# EAGLE design flossjtag (EAGLE 7.4.0)
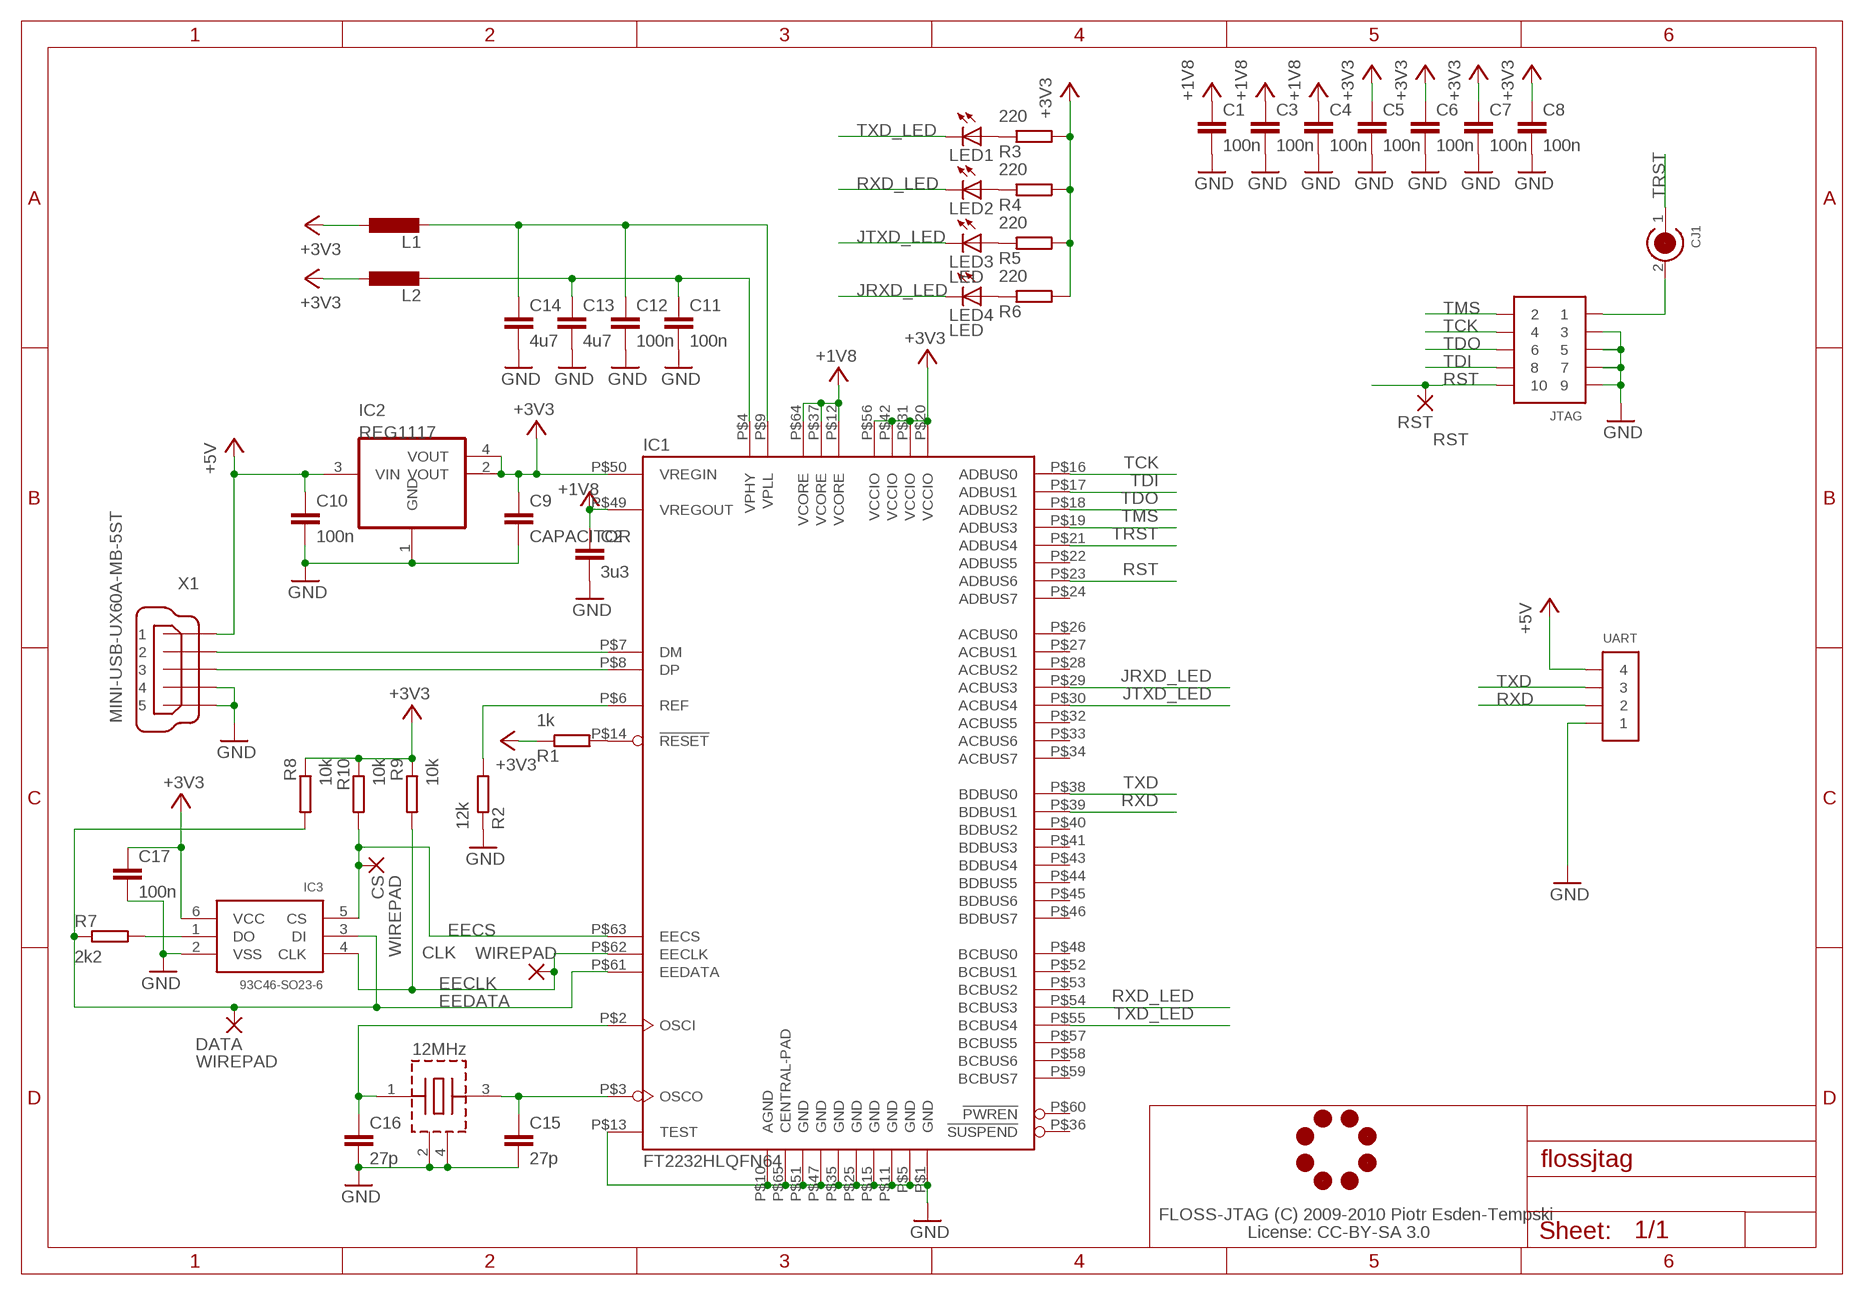
[diagram p0: schematic, sheet 1]

## Parts
C1  100n  CAPACITOR-0603  [0603-CAP]
C2  3u3  CAPACITOR-0603  [0603-CAP]
C3  100n  CAPACITOR-0603  [0603-CAP]
C4  100n  CAPACITOR-0603  [0603-CAP]
C5  100n  CAPACITOR-0603  [0603-CAP]
C6  100n  CAPACITOR-0603  [0603-CAP]
C7  100n  CAPACITOR-0603  [0603-CAP]
C8  100n  CAPACITOR-0603  [0603-CAP]
C9  CAPACITOR  [0603-CAP]
C10  100n  CAPACITOR  [0603-CAP]
C11  100n  CAPACITOR-0603  [0603-CAP]
C12  100n  CAPACITOR-0603  [0603-CAP]
C13  4u7  CAPACITOR-0603  [0603-CAP]
C14  4u7  CAPACITOR-0603  [0603-CAP]
C15  27p  CAPACITOR  [0603-CAP]
C16  27p  CAPACITOR  [0603-CAP]
C17  100n  CAPACITOR  [0603-CAP]
CJ1  CIRC_JMP  [CIRC_JMP]
CLK  WIREPAD  [SMD1,27]
CS  WIREPAD  [SMD1,27]
DATA  WIREPAD  [SMD1,27]
IC1  FT2232HLQFN64  [QFN64]
IC2  REG1117  [SOT223]
IC3  93C46-SO23-6  [SO23-6]
JL1  JOBY_LOGO-6MIL  [JOBY_LOGO_6MIL]
JTAG  CONN_5-2-FTSH-V  [FTSH-105-DV]
L1  INDUCTOR-0603  [0603-IND]
L2  INDUCTOR-0603  [0603-IND]
LED1  LED  [0603-LED]
LED2  LED  [0603-LED]
LED3  LED  [0603-LED]
LED4  LED  [0603-LED]
R1  1k  RESISTOR-0603  [0603-RES]
R2  12k  RESISTOR-0603  [0603-RES]
R3  220  RESISTOR-0603  [0603-RES]
R4  220  RESISTOR-0603  [0603-RES]
R5  220  RESISTOR-0603  [0603-RES]
R6  220  RESISTOR-0603  [0603-RES]
R7  2k2  RESISTOR-0603  [0603-RES]
R8  10k  RESISTOR-0603  [0603-RES]
R9  10k  RESISTOR-0603  [0603-RES]
R10  10k  RESISTOR-0603  [0603-RES]
RST  RST  WIREPAD  [SMD1,27]
UART  CONN_4-1  [PB-53261-04]
X1  MINI-USB-UX60A-MB-5ST  [UX60A-MB-5ST]
X3  12MHz  NX3225SA  [NX3225SA]

## Nets
+3V3: C5.P$1 C6.P$1 C7.P$1 C8.P$1 C9.P$1 C17.P$1 IC1.P$20(VCCIO) IC1.P$31(VCCIO) IC1.P$42(VCCIO) IC1.P$50(VREGIN) IC1.P$56(VCCIO) IC2.2(VOUT) IC2.4(VOUT) IC3.6(VCC) L1.P$1 L2.P$1 R1.P$1 R3.P$2 R4.P$2 R5.P$2 R6.P$2 R8.P$1 R9.P$1 R10.P$1
+5V: C10.P$1 IC2.3(VIN) UART.4 X1.1
EECLK: CLK.1(P) IC1.P$62(EECLK) IC3.4(CLK) R9.P$2
EECS: CS.1(P) IC1.P$63(EECS) IC3.5(CS) R10.P$2
EEDATA: DATA.1(P) IC1.P$61(EEDATA) IC3.3(DI) R7.P$1 R8.P$2
GND: C1.P$2 C2.P$2 C3.P$2 C4.P$2 C5.P$2 C6.P$2 C7.P$2 C8.P$2 C9.P$2 C10.P$2 C11.P$2 C12.P$2 C13.P$2 C14.P$2 C15.P$2 C16.P$2 C17.P$2 IC1.P$1(GND) IC1.P$5(GND) IC1.P$10(AGND) IC1.P$11(GND) IC1.P$13(TEST) IC1.P$15(GND) IC1.P$25(GND) IC1.P$35(GND) IC1.P$47(GND) IC1.P$51(GND) IC1.P$65(CENTRAL-PAD) IC2.1(GND) IC3.2(VSS) JTAG.3 JTAG.5 JTAG.7 JTAG.9 R2.P$1 UART.1 X1.4 X1.5 X3.2(GND) X3.4(GND)
JRXD_LED: IC1.P$29(ACBUS3) LED4.C
JTXD_LED: IC1.P$30(ACBUS4) LED3.C
N$1: IC1.P$14(!RESET) R1.P$2
N$2: IC1.P$6(REF) R2.P$2
N$3: IC1.P$7(DM) X1.2
N$4: IC1.P$8(DP) X1.3
N$6: C16.P$1 IC1.P$2(OSCI) X3.1(XTAL)
N$7: C12.P$1 C14.P$1 IC1.P$9(VPLL) L1.P$2
N$8: C11.P$1 C13.P$1 IC1.P$4(VPHY) L2.P$2
N$9: C15.P$1 IC1.P$3(OSCO) X3.3(XTAL)
N$10: LED1.A R3.P$1
N$11: LED2.A R4.P$1
N$12: LED3.A R5.P$1
N$13: LED4.A R6.P$1
N$17: IC3.1(DO) R7.P$2
N$19: CJ1.2 JTAG.1
RST: IC1.P$23(ADBUS6) JTAG.10 RST.1(P)
RXD: IC1.P$39(BDBUS1) UART.2
RXD_LED: IC1.P$54(BCBUS3) LED2.C
TCK: IC1.P$16(ADBUS0) JTAG.4
TDI: IC1.P$17(ADBUS1) JTAG.8
TDO: IC1.P$18(ADBUS2) JTAG.6
TMS: IC1.P$19(ADBUS3) JTAG.2
TRST: CJ1.1 IC1.P$21(ADBUS4)
TXD: IC1.P$38(BDBUS0) UART.3
TXD_LED: IC1.P$55(BCBUS4) LED1.C
VCC: C1.P$1 C2.P$1 C3.P$1 C4.P$1 IC1.P$12(VCORE) IC1.P$37(VCORE) IC1.P$49(VREGOUT) IC1.P$64(VCORE) ; supply symbol labelled +1V8
Unconnected: IC1.P$22(ADBUS5) IC1.P$24(ADBUS7) IC1.P$26(ACBUS0) IC1.P$27(ACBUS1) IC1.P$28(ACBUS2) IC1.P$32(ACBUS5) IC1.P$33(ACBUS6) IC1.P$34(ACBUS7) IC1.P$36(!SUSPEND) IC1.P$40(BDBUS2) IC1.P$41(BDBUS3) IC1.P$43(BDBUS4) IC1.P$44(BDBUS5) IC1.P$45(BDBUS6) IC1.P$46(BDBUS7) IC1.P$48(BCBUS0) IC1.P$52(BCBUS1) IC1.P$53(BCBUS2) IC1.P$57(BCBUS5) IC1.P$58(BCBUS6) IC1.P$59(BCBUS7) IC1.P$60(!PWREN)

## Notes on the sheet
- FLOSS-JTAG (C) 2009-2010 Piotr Esden-Tempski
- License: CC-BY-SA 3.0

## Library data of the parts
C1-C8 C11-C14 = res_cap:CAPACITOR
C9 C10 C15-C17 = open-bldc:CAPACITOR
CJ1 = fancy_jumpers:CIRC_JMP
CLK CS DATA RST = wirepad:WIREPAD: Wire PAD connect wire on PCB
IC1 = ftdi-jtag:FT2232HL
IC2 = burr-brown:REG1117: 800mA and 1A Low Dropout (LDO) Positive Regulator 1.8V, 2.5V, 2.85V, 3.3V, 5V, and Adj
IC3 = misc:93C46: Microchip: 93AA46A/B/C, 93LC46A/B/C, 93C46A/B/C
JL1 = aspirin:JOBY_LOGO
JTAG = pel_misc:CONN_5-2
L1 L2 = res_cap:INDUCTOR
LED1-LED4 = open-bldc:LED
R1-R10 = res_cap:RESISTOR
UART = open-bldc:CONN_4-1
X1 = con-hirose:MINI-USB-: MINI USB Connector Source: http://www.hirose.co.jp/cataloge_hp/e24000019.pdf
X3 = misc:NX3225SA

## Board
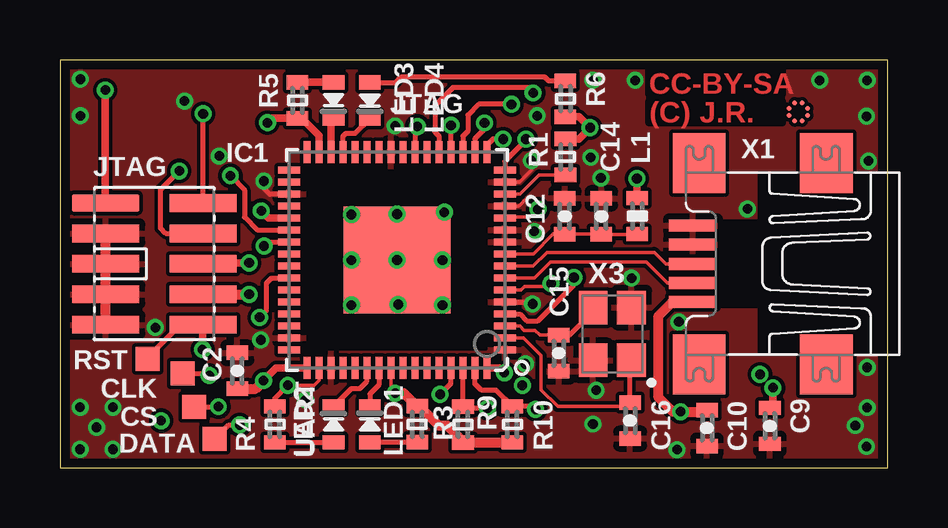
[diagram p1: board, top side]
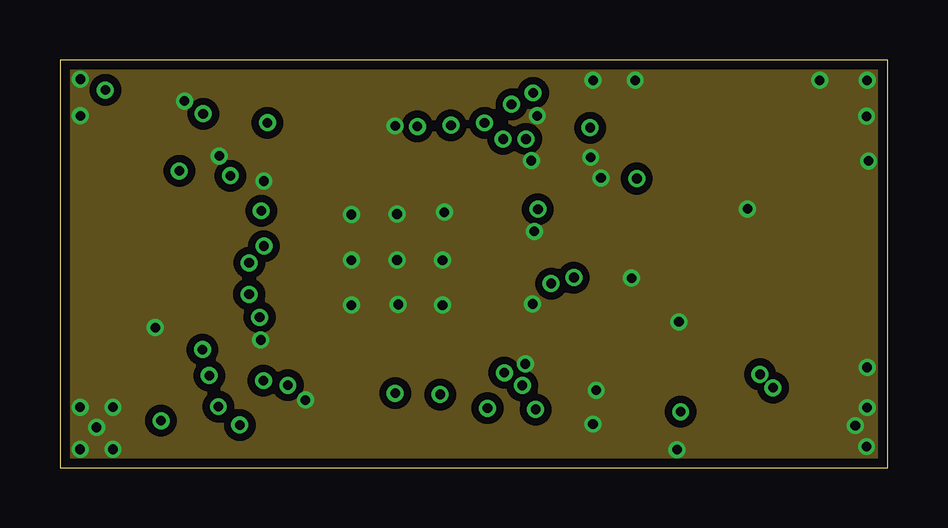
[diagram p2: board, inner layer Route2]
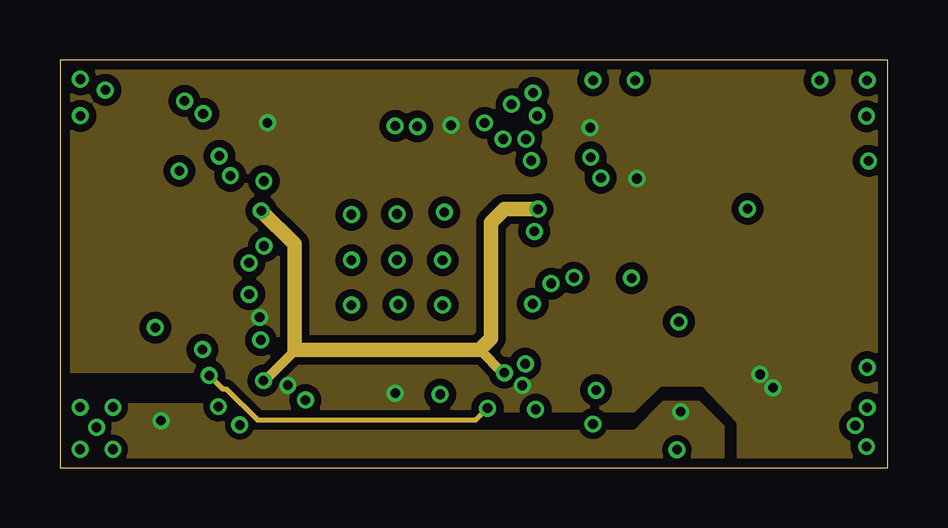
[diagram p3: board, inner layer Route15]
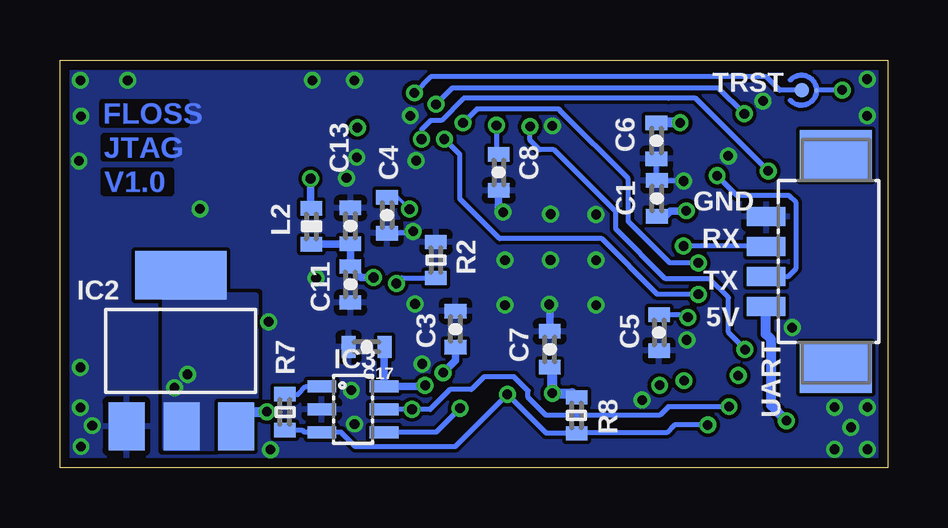
[diagram p4: board, bottom side, seen from below]

Size 34.5 x 17 mm. Coordinates in mm from the lower left corner, seen from the top.
Outline: 0,0 34.5,0 34.5,17 0,17 0,0
Copper layers (1*2+15*16): Top 0.035mm / dielectric 0.3mm / Route2 0.035mm / dielectric 0.15mm / Route15 0.035mm / dielectric 0.3mm / Bottom 0.035mm
Design rules "default *": minimum track width 6mil, minimum drill 13mil, track to track 6mil, track to pad 7mil, pad to pad 7mil, via to via 7mil, smd to smd 6mil, copper to edge 15mil, drill to drill 8mil, minimum pad ring 0.1mm, minimum via ring 6mil, stop-mask expansion 4mil, vias tented up to drill 0.4mm, thermal gap 10mil

### Footprints (pad centres in the part's own frame; a part is rotated, then mirrored left to right if it is on the bottom)
0603-CAP = smd 0.6 x 0.9: P$1 -0.75,0; P$2 0.75,0
CIRC_JMP = smd 0.61 x 0.61: 1 0,0 | smd 0.203 x 0.203: 2 0,0.617
SMD1,27 = smd 1 x 1: 1 0,0
QFN64 = smd 0.9 x 0.3: P$1 -4.5,3.75; P$2 -4.5,3.25; P$3 -4.5,2.75; P$4 -4.5,2.25; P$5 -4.5,1.75; P$6 -4.5,1.25; P$7 -4.5,0.75; P$8 -4.5,0.25; P$9 -4.5,-0.25; P$10 -4.5,-0.75; P$11 -4.5,-1.25; P$12 -4.5,-1.75; P$13 -4.5,-2.25; P$14 -4.5,-2.75; P$15 -4.5,-3.25; P$16 -4.5,-3.75; P$33 4.5,-3.75; P$34 4.5,-3.25; P$35 4.5,-2.75; P$36 4.5,-2.25; P$37 4.5,-1.75; P$38 4.5,-1.25; P$39 4.5,-0.75; P$40 4.5,-0.25; P$41 4.5,0.25; P$42 4.5,0.75; P$43 4.5,1.25; P$44 4.5,1.75; P$45 4.5,2.25; P$46 4.5,2.75; P$47 4.5,3.25; P$48 4.5,3.75 | smd 0.3 x 0.9: P$17 -3.75,-4.5; P$18 -3.25,-4.5; P$19 -2.75,-4.5; P$20 -2.25,-4.5; P$21 -1.75,-4.5; P$22 -1.25,-4.5; P$23 -0.75,-4.5; P$24 -0.25,-4.5; P$25 0.25,-4.5; P$26 0.75,-4.5; P$27 1.25,-4.5; P$28 1.75,-4.5; P$29 2.25,-4.5; P$30 2.75,-4.5; P$31 3.25,-4.5; P$32 3.75,-4.5; P$49 3.75,4.5; P$50 3.25,4.5; P$51 2.75,4.5; P$52 2.25,4.5; P$53 1.75,4.5; P$54 1.25,4.5; P$55 0.75,4.5; P$56 0.25,4.5; P$57 -0.25,4.5; P$58 -0.75,4.5; P$59 -1.25,4.5; P$60 -1.75,4.5; P$61 -2.25,4.5; P$62 -2.75,4.5; P$63 -3.25,4.5; P$64 -3.75,4.5 | smd 4.45 x 4.45: P$65 0,0
SOT223 = smd 1.499 x 2.007: 1 -2.261,-3.15; 2 0.025,-3.15; 3 2.311,-3.15 | smd 3.81 x 2.007: 4 0,3.15
SO23-6 = smd 0.5 x 1.2: 1 -0.95,-1.3; 2 0,-1.3; 3 0.95,-1.3; 4 0.95,1.3; 5 0,1.3; 6 -0.95,1.3
JOBY_LOGO_6MIL = smd 0.203 x 0.203: 1 -0.152,0.381; 2 0.152,0.381; 3 0.381,0.152; 4 0.381,-0.152; 5 0.152,-0.381; 6 -0.152,-0.381; 7 -0.381,-0.152; 8 -0.381,0.152
FTSH-105-DV = smd 0.74 x 2.8: 1 -2.54,-2.03; 2 -2.54,2.03; 3 -1.27,-2.03; 4 -1.27,2.03; 5 0,-2.03; 6 0,2.03; 7 1.27,-2.03; 8 1.27,2.03; 9 2.54,-2.03; 10 2.54,2.03
0603-IND = smd 0.6 x 0.9: P$1 -0.75,0; P$2 0.75,0
0603-LED = smd 0.6 x 0.9: A 0.75,0; C -0.75,0
0603-RES = smd 0.6 x 0.9: P$1 -0.75,0; P$2 0.75,0
PB-53261-04 = smd 0.8 x 1.6: 1 1.875,1.1; 2 0.625,1.1; 3 -0.625,1.1; 4 -1.875,1.1 | smd 2.1 x 3: MNT1 -4.425,-1.8; MNT2 4.425,-1.8
UX60A-MB-5ST = smd 2 x 0.5: 1 2.25,1.6; 2 2.25,0.8; 3 2.25,0; 4 2.25,-0.8; 5 2.25,-1.6 | smd 2.2 x 2.5: M1 -3.3,-4.2; M2 -3.3,4.2; M3 2,4.2; M4 2,-4.2
NX3225SA = smd 1.4 x 1.2: 1 -1.1,-0.8; 2 1.1,-0.8; 3 1.1,0.8; 4 -1.1,0.8

### Placement (x,y rotation side)
C1  9.61,11.22 90 bottom
C2  7.4,4.04 90 top
C3  18.01,5.77 90 bottom
C4  20.86,10.53 270 bottom
C5  9.53,5.63 270 bottom
C6  9.63,13.63 270 bottom
C7  14.08,4.93 90 bottom
C8  16.21,12.31 270 bottom
C9  29.59,1.74 270 top
C10  26.98,1.65 270 top
C11  22.39,7.64 270 bottom
C12  21.04,10.48 90 top
C13  22.39,10.08 90 bottom
C14  22.57,10.48 90 top
C15  20.79,4.76 270 top
C16  23.77,1.96 270 top
C17  21.72,5.03 180 bottom
CJ1  3.58,15.74 270 bottom
CLK  5.11,3.94 0 top
CS  5.59,2.54 0 top
DATA  6.45,1.19 0 top
DRILEGEND  [DRILEGEND]  -2.76,-5.53 0 top  (outside the outline)
IC1  14.05,8.65 180 top
IC2  29.46,4.87 0 bottom
IC3  22.28,2.43 270 bottom
JL1  30.78,14.83 0 top
JTAG  3.94,8.5 270 top
L1  24.07,10.49 270 top
L2  24.02,10.06 270 bottom
LED1  12.92,1.8 270 top
LED2  11.4,1.8 270 top
LED3  11.4,15.32 90 top
LED4  12.92,15.31 90 top
R1  21.07,12.95 270 top
R2  18.83,8.66 270 bottom
R3  14.89,1.8 90 top
R4  8.96,1.8 90 top
R5  9.9,15.31 270 top
R6  21.07,15.38 270 top
R7  25.12,2.32 90 bottom
R8  12.96,2.18 270 bottom
R9  16.8,1.79 90 top
R10  18.86,1.8 90 top
RST  3.66,4.52 0 top
UART  3.96,8.6 90 bottom
X1  28.64,8.5 180 top
X3  23.03,5.57 90 top

### Tracks (layer width: path | path; a pad name or v marks a point on that pad's centre or on a via)
+3V3  (via drill 0.4 pad 0.64)
  Top 0.152: R4.P$2 8.9,2.55 | R3.P$2 14.75,2.55 | R3.P$2 15.05,2.55 | R9.P$1 16.86,1.04 | 15,2.55 R3.P$2 | R5.P$2 9.88,14.55 | v9.5,3.43 10.59,3.43 10.79,3.63 IC1.P$50 | IC1.P$56 13.8,3.27 v13.97,3.1
  Top 0.203: IC1.P$42 8.82,7.91 8.61,7.7 8.61,6.55 v8.32,6.26 | IC1.P$20 v16.3,14.28 | R4.P$2 8.96,2.9 v9.5,3.43
  Top 0.305: IC1.P$31 10.8,13.85 10.1,14.55 9.88,14.55 9.63,14.55 | R6.P$2 21.64,14.63 v22.1,14.18 21.63,13.7 R1.P$1 | L1.P$1 24.05,11.26 v24.05,12.05 | v8.65,14.38 8.83,14.56 R5.P$2 | C9.P$1 29.73,2.62 v29.73,3.33
  Top 0.406: 15,2.55 15.8,1.75 16.15,1.75 16.8,1.1 R9.P$1 | v13.97,3.1 14.34,3.1 R3.P$2 | 16.86,1.04 16.86,1.05 R10.P$1
  Bottom 0.203: C5.P$1 8.44,6.38 v8.32,6.26 | C8.P$1 IC1.P$20 16.3,13.72 v16.3,14.28
  Bottom 0.305: v19.27,3.42 19.32,3.38 IC3.6 20.98,5.01 C17.P$1 | L2.P$1 24.05,10.84 v24.05,12.05
  Bottom 0.406: C6.P$1 v8.65,14.38 | C7.P$1 13.97,4.08 v13.97,3.1 13.14,3.1 R8.P$1
  Bottom 0.813: IC2.4 29.21,7.77
  other vias: 29.18,3.89
  pour Route15 (isolate 0.305): 0,4.05 6.67,4.04 8.1,2.4 23.9,2.4 25,3.5 26.8,3.5 28.3,1.9 28.3,0 34.5,0 34.5,17 0,17
  pour Bottom (no thermals): 26.37,0.84 26.37,7.16 30.1,7.16 30.1,0.84
+5V  (via drill 0.4 pad 0.64)
  Top 0.406: X1.1 25.52,6.9 24.95,6.33 24.95,2.93 25.55,2.33 v25.88,2.33 26.9,2.33 C10.P$1
  Bottom 0.203: IC2.3 27.15,1.88 26.7,2.33
  Bottom 0.406: 26.7,2.33 v25.88,2.33 | UART.4 5.08,6.72 5.08,5.56 4.85,5.33 4.85,2.59 v4.22,1.96
  pour Route15 (isolate 0.254): 0,0 0,2.6 6.6,2.6 7.5,1.5 24,1.5 25.2,2.7 26.6,2.7 27.6,1.7 27.6,0
EECLK  (via drill 0.4 pad 0.64)
  Top 0.203: CLK.1 6.12,3.94 v6.22,3.83 | IC1.P$62 | IC1.P$62 R9.P$2 16.87,2.47 v17.82,2.47
  Route15 0.203: v6.22,3.83 6.78,3.28 6.93,3.28 8.23,1.98 17.3,1.98 17.33,1.98 v17.82,2.47
  Bottom 0.203: v17.82,2.47 18.82,1.48 IC3.4
EECS  (via drill 0.4 pad 0.64)
  Top 0.203: IC1.P$63 17.3,3.5 17.58,3.22 18.19,3.22 R10.P$2 19.7,2.55 v19.82,2.42 | CS.1 v6.6,2.54
  Bottom 0.203: v6.6,2.54 9.14,2.54 9.5,2.18 14.25,2.18 14.99,2.92 14.99,3.2 15.57,3.79 16.82,3.79 17.35,3.25 18.24,3.25 19.06,2.42 v19.82,2.42 IC3.5
EEDATA  (via drill 0.4 pad 0.64)
  Top 0.203: IC1.P$61 16.3,3.5 v15.85,3.05 | DATA.1 7.04,1.78 v7.49,1.78
  Bottom 0.152: 25.11,1.55 R7.P$1
  Bottom 0.203: 25.11,1.55 24.38,1.55 24.3,1.48 IC3.3 22.78,1.48 22.18,0.88 18.02,0.88 v15.85,3.05 14.25,1.45 14.23,1.43 R8.P$2 12.94,1.45 9.21,1.45 8.88,1.78 v7.49,1.78
GND  (via drill 0.4 pad 0.64)
  Top 0.152: IC1.P$47 | IC1.P$15 19.16,11.9 19.65,12.4 v19.65,12.8 | IC1.P$13 19.14,10.9 19.43,11.2
  Top 0.203: IC1.P$35 8.74,11.4 8.5,11.65 v8.5,11.95 | IC1.P$5 19.62,6.91 v19.7,6.83
  Top 0.305: IC1.P$1 18.74,4.91
  Top 0.406: JTAG.3 JTAG.5 JTAG.7 JTAG.9
  Bottom 0.152: 14.08,6.78 v14.1,6.8 | R2.P$1 19.05,9.41
  Bottom 0.203: v8.5,11.95 9.59,11.95 C1.P$2 9.63,11.99 C6.P$2 | C4.P$2 19.7,9.78 v19.77,9.85 | IC2.1 31.75,1.75
  Bottom 0.305: C7.P$2 14.08,6.78 | C8.P$2 16.21,10.84 v16.02,10.65
  other vias: 33.62,0.88 33.65,2.5 22.12,12.94 33.65,16.15 31.68,16.15 33.62,14.65 8.37,5.32 10.23,2.82 13.97,14.25 22.55,12.08 33.16,1.75 23.82,7.9 12.15,6.78 15.95,6.78 15.95,8.65 14.05,10.57 14.05,8.65 12.15,8.65 12.15,10.55 19.4,4.32 22.35,3.22 0.84,0.76 2.21,2.51 22.23,16.15 23.98,16.15 33.71,12.79 33.65,4.18 25.8,6.08 25.73,0.75 22.22,1.81 2.21,0.76 0.84,2.51 0.85,14.67 0.85,16.2 28.66,10.79 19.9,14.67 3.97,5.84 6.64,13 5.19,15.28 1.52,1.68
  pour Route2 (isolate 0.305): 0,0 34.5,0 34.5,17 0,17
  pour Top: 0,0 34.5,0 34.5,17 -0.05,17.03
  pour Bottom (rank 6): 0,0 34.5,0 34.5,17 -0.05,17.03
JRXD_LED
  Top 0.203: IC1.P$29 11.8,13.82 11.92,13.94 12.31,13.94 LED4.C
JTXD_LED
  Top 0.305: LED3.C 11.3,14.46 IC1.P$30
N$1
  Top 0.152: IC1.P$14 19.18,11.4 19.98,12.2 R1.P$2
N$2  (via drill 0.4 pad 0.64)
  Top 0.152: v20.47,7.67 20.34,7.54 19.36,7.54 19.22,7.41 IC1.P$6
  Bottom 0.203: R2.P$2 20.24,7.91 v20.47,7.67
N$3
  Top 0.152: X1.2 25.32,7.7 24.45,8.57 20.45,8.57 19.79,7.91 IC1.P$7
N$4
  Top 0.152: X1.3 25.25,8.5 24.77,8.97 20.29,8.97 19.72,8.41 IC1.P$8
N$6
  Top 0.152: IC1.P$2 19.32,5.41 20.05,4.67 20.05,3.25 20.75,2.55 23.61,2.55 C16.P$1 | 23.77,4.41 X3.1
  Top 0.203: C16.P$1 23.77,4.41
N$7
  Top 0.152: IC1.P$9 18.56,8.91 19.74,8.91 20.55,9.73 C12.P$1 C14.P$1 24.06,9.73 L1.P$2
N$8  (via drill 0.4 pad 0.64)
  Top 0.203: IC1.P$4 19.17,6.41 19.45,6.12 19.92,6.12 21.43,7.62 v21.43,7.92
  Bottom 0.305: C13.P$1 C11.P$1 22.39,8.37 21.95,7.92 v21.43,7.92 | C13.P$1 | C13.P$1 24,9.33 L2.P$2
N$9
  Top 0.152: IC1.P$3 19.17,5.91 19.35,5.72 19.8,5.72 20,5.53 20.78,5.53 C15.P$1 | 22.23,6.5 X3.3
  Top 0.203: C15.P$1 21.24,5.51 22.23,6.5
N$10
  Top 0.152: R3.P$1
  Top 0.203: R3.P$1 LED1.A
N$11
  Top 0.203: R4.P$1 LED2.A
N$12
  Top 0.305: R5.P$1 LED3.A
N$13
  Top 0.203: LED4.A 13.98,16.06 14.22,16.3 20.2,16.3 20.37,16.13 R6.P$1
N$17
  Bottom 0.152: R7.P$2 25.11,3.05
  Bottom 0.203: IC3.1 24.25,3.38 24.58,3.05 25.11,3.05
N$19  (via drill 0.4 pad 0.64)
  Top 0.305: JTAG.1 1.89,11.05 v1.89,15.74
  Bottom 0.203: v1.89,15.74 CJ1.2
RST  (via drill 0.4 pad 0.64)
  Top 0.152: IC1.P$23
  Top 0.203: RST.1 3.66,4.6 5,5.94 5.96,5.94 JTAG.10 | IC1.P$23 14.8,14.13 v14.9,14.23
  Top 0.305: JTAG.10 5.95,5.93 v5.95,4.92
  Bottom 0.203: v5.95,4.92 5.95,4.96 6.63,5.64 6.63,7.09 7.42,7.87 9.25,7.87 11.33,9.95 11.33,10.68 13.91,13.26 13.92,13.26 14.5,13.26 14.9,13.65 v14.9,14.23
RXD  (via drill 0.4 pad 0.64)
  Top 0.152: IC1.P$39
  Top 0.203: IC1.P$39 8.67,9.41 v8.5,9.24
  Bottom 0.203: UART.2 5.08,9.24 v8.5,9.24
RXD_LED
  Top 0.203: IC1.P$54 12.8,3.6 12.5,3.3 12.28,3.3 12.15,3.3 LED2.C
TCK  (via drill 0.4 pad 0.64)
  Top 0.203: v4.97,12.37 4.19,11.59 4.19,9.98 4.41,9.77 JTAG.4 | IC1.P$16 18.55,12.78 19.43,13.65 v19.43,13.7
  Bottom 0.203: v4.97,12.37 8,15.4 9.12,15.4 17.68,15.4 18.6,14.48 19.05,14.48 19.43,14.1 v19.43,13.7
TDI  (via drill 0.4 pad 0.64)
  Top 0.203: IC1.P$17 17.8,13.45 18.05,13.7 v18.48,13.7
  Top 0.406: JTAG.8 v7.88,7.23 v7.88,7.22
  Bottom 0.203: v7.88,7.22 9.6,7.22 11.92,9.54 16.17,9.54 17.83,11.2 17.83,13.05 v18.48,13.7
TDO  (via drill 0.4 pad 0.64)
  Top 0.203: v17.7,14.37 17.7,14.12 17.3,13.72 IC1.P$18
  Top 0.305: JTAG.6 6.01,8.54 v7.89,8.54
  Bottom 0.203: v17.7,14.37 17.12,14.95 13.7,14.95 13.62,14.88 13.62,14.87 10.81,12.05 10.81,10.26 9.08,8.54 v7.89,8.54
TMS  (via drill 0.4 pad 0.64)
  Top 0.203: IC1.P$19 16.8,13.83 17,14.03 17,14.7 17.45,15.15 v18.82,15.15 | v5.97,14.75 JTAG.2
  Bottom 0.203: v18.82,15.15 18.15,15.82 8.3,15.82 7.04,15.82 v5.97,14.75
TRST  (via drill 0.4 pad 0.64)
  Top 0.203: IC1.P$21 15.8,13.82 15.62,14 15.62,15.1 16.38,15.85 19.5,15.85 v19.73,15.62
  Bottom 0.203: CJ1.1 4.49,15.74 5.06,16.3 19.05,16.3 v19.73,15.62
TXD  (via drill 0.4 pad 0.64)
  Top 0.152: IC1.P$38
  Top 0.203: IC1.P$38 8.23,9.91 7.7,10.44 7.7,11.58 v7.1,12.17
  Bottom 0.203: v7.1,12.17 6.29,11.35 4.12,11.35 3.81,11.05 3.81,8.31 4.14,7.97 UART.3
TXD_LED
  Top 0.203: IC1.P$55 13.3,3.45 12.92,3.07 LED1.C
VCC  (via drill 0.4 pad 0.64)
  Top 0.152: IC1.P$49 10.27,4.13 | v19.93,10.78 19.59,10.44 19.13,10.44 18.59,10.44 IC1.P$12
  Top 0.305: IC1.P$37 8.69,10.4 v8.39,10.71 | IC1.P$64 18.32,4.16 v18.53,3.95 | IC1.P$49 9.02,4.16 v8.49,3.62
  Top 0.406: C2.P$1 8.15,3.29 v8.49,3.62
  Route15 0.406: v8.49,3.62 8.56,3.62 9.83,4.9 | v18.53,3.95 18.45,3.95 17.51,4.9
  Route15 0.61: v8.39,10.71 9.78,9.32 9.78,4.9 9.83,4.9 17.48,4.9 | v19.93,10.78 18.53,10.78 17.98,10.22 17.98,5.52 17.98,5.39 17.48,4.9 | 17.48,4.9 17.51,4.9
  Bottom 0.152: C1.P$1 | C4.P$1 20.43,11.28 v19.93,10.78
  Bottom 0.305: v8.39,10.71 9.05,10.71 9.28,10.48 C1.P$1 | C3.P$1 18.01,4.47 v18.53,3.95

### Text on the board
Top: CC-BY-SA | (C) J.R.
Bottom: FLOSS | JTAG | V1.0
tPlace: JTAG | UART
bPlace: TRST | GND | RX | TX | 5V
tNames: X3
tStop: CC-BY-SA | (C) J.R.
bStop: FLOSS | JTAG | V1.0
_tNames: IC1 | R6 | R5 | LED3 | LED4 | R1 | L1 | X1 | C14 | X2 | C12 | C15 | S1 | C2 | LED2 | LED1 | C16 | C10 | C9 | R9 | R4 | R3 | R10
_bNames: C6 | X4 | C8 | C4 | C13 | C1 | L2 | R2 | C11 | C5 | IC2 | C3 | IC3 | C7 | R8 | R7